# Altium schematic sheet XBee.SchDoc
size A
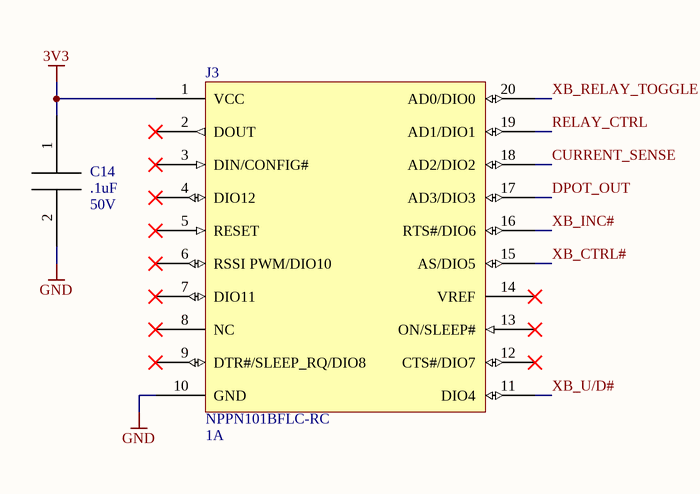
[diagram p0: XBee.SchDoc]

## Parts
C14  value .1uF  Rating: 50V  [0603]  (hidden comment: C_CAP_0603)
J3  Rating: 1A  [NPPN101BFLC-RC]  (hidden comment: J_XBEE_NPPN101BFLC-RC)

## Nets
3V3: C14.1 J3.1(VCC)
GND: C14.2 J3.10(GND)
CURRENT_SENSE: J3.18(AD2/DIO2)
DPOT_OUT: J3.17(AD3/DIO3)
RELAY_CTRL: J3.19(AD1/DIO1)
XB_CTRL#: J3.15(AS/DIO5)
XB_INC#: J3.16(RTS#/DIO6)
XB_RELAY_TOGGLE: J3.20(AD0/DIO0)
XB_U/D#: J3.11(DIO4)

Not connected (* = marked no-connect by the designer): J3 2(DOUT)* 3(DIN/CONFIG#)* 4(DIO12)* 5(RESET)* 6(RSSI_PWM/DIO10)* 7(DIO11)* 8(NC)* 9(DTR#/SLEEP_RQ/DIO8)* 12(CTS#/DIO7)* 13(ON/SLEEP#)* 14(VREF)*

## Library data of the parts
J3 = J_XBEE_NPPN101BFLC-RC: Manufacturer: Sullins Connector Solutions; PartNumber: NPPN101BFLC-RC